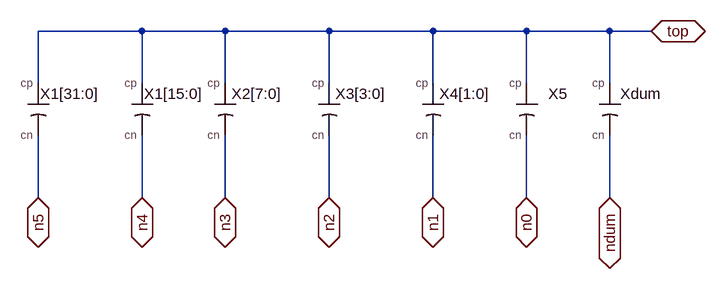
[diagram p0: schematic carray.asc]
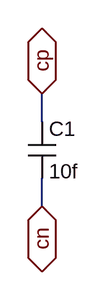
[diagram p1: sub-circuit unit_cap.asc]
carray.asc, the LTspice schematic file:
Version 4
SHEET 1 1312 680
WIRE 416 112 256 112
WIRE 544 112 416 112
WIRE 704 112 544 112
WIRE 864 112 704 112
WIRE 1008 112 864 112
WIRE 1136 112 1008 112
WIRE 1200 112 1136 112
WIRE 256 192 256 112
WIRE 416 192 416 112
WIRE 544 192 544 112
WIRE 704 192 704 112
WIRE 864 192 864 112
WIRE 1008 192 1008 112
WIRE 1136 192 1136 112
WIRE 256 368 256 272
WIRE 416 368 416 272
WIRE 544 368 544 272
WIRE 704 368 704 272
WIRE 864 368 864 272
WIRE 1008 368 1008 272
WIRE 1136 368 1136 272
FLAG 256 368 n5
IOPIN 256 368 BiDir
FLAG 416 368 n4
IOPIN 416 368 BiDir
FLAG 544 368 n3
IOPIN 544 368 BiDir
FLAG 704 368 n2
IOPIN 704 368 BiDir
FLAG 864 368 n1
IOPIN 864 368 BiDir
FLAG 1136 368 ndum
IOPIN 1136 368 BiDir
FLAG 1200 112 top
IOPIN 1200 112 BiDir
FLAG 1008 368 n0
IOPIN 1008 368 BiDir
SYMBOL unit_cap 352 240 R0
SYMATTR InstName X1[31:0]
SYMBOL unit_cap 512 240 R0
SYMATTR InstName X1[15:0]
SYMBOL unit_cap 640 240 R0
SYMATTR InstName X2[7:0]
SYMBOL unit_cap 800 240 R0
SYMATTR InstName X3[3:0]
SYMBOL unit_cap 960 240 R0
SYMATTR InstName X4[1:0]
SYMBOL unit_cap 1232 240 R0
SYMATTR InstName Xdum
SYMBOL unit_cap 1104 240 R0
SYMATTR InstName X5

unit_cap.asc, the sub-circuit schematic file:
Version 4
SHEET 1 880 680
WIRE 240 160 240 128
WIRE 240 256 240 224
FLAG 240 256 cn
IOPIN 240 256 BiDir
FLAG 240 128 cp
IOPIN 240 128 BiDir
SYMBOL cap 224 160 R0
SYMATTR InstName C1
SYMATTR Value 10f

The netlist it stands for:
* carray.asc
XX1[31:0] n5 top unit_cap
XX1[15:0] n4 top unit_cap
XX2[7:0] n3 top unit_cap
XX3[3:0] n2 top unit_cap
XX4[1:0] n1 top unit_cap
XXdum ndum top unit_cap
XX5 n0 top unit_cap

* block symbol definitions
.subckt unit_cap cn cp
C1 cp cn 10f
.ends unit_cap

.backanno
.end